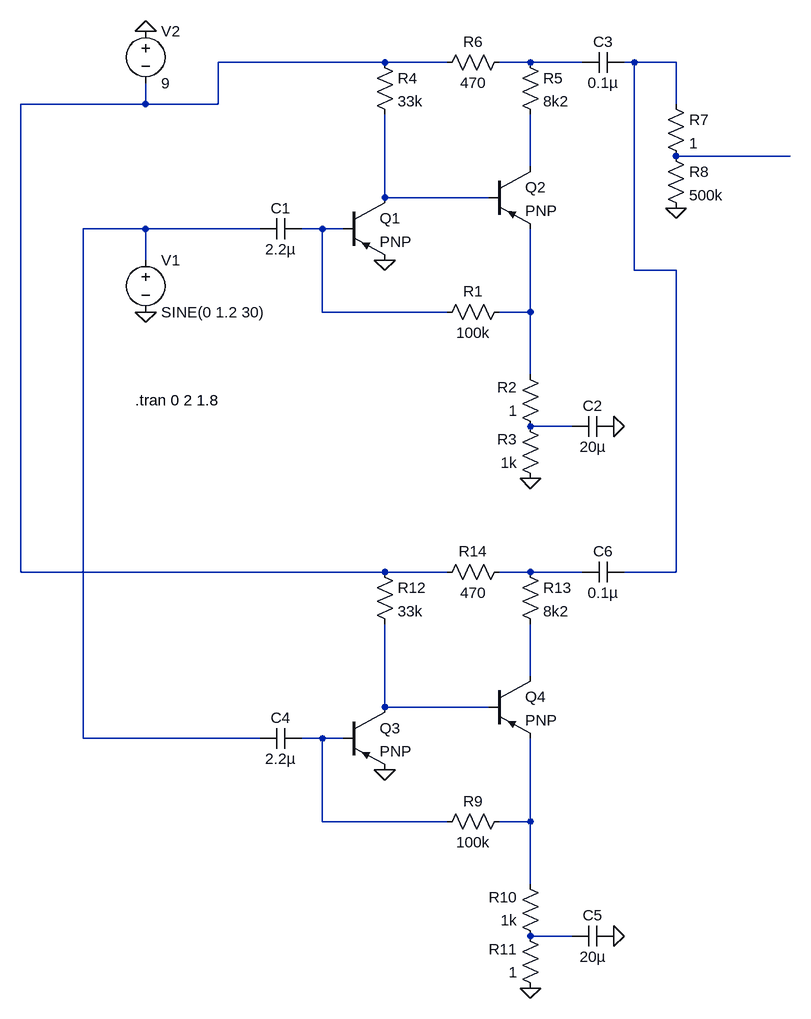
[diagram p0: schematic Draft1.asc]
Draft1.asc, the LTspice schematic file:
Version 4
SHEET 1 880 1220
WIRE 192 -224 -64 -224
WIRE 288 -224 192 -224
WIRE 416 -224 368 -224
WIRE 496 -224 416 -224
WIRE 576 -224 560 -224
WIRE 640 -224 576 -224
WIRE -176 -160 -176 -192
WIRE -176 -160 -368 -160
WIRE -64 -160 -64 -224
WIRE -64 -160 -176 -160
WIRE 640 -160 640 -224
WIRE 816 -80 640 -80
WIRE 416 -64 416 -144
WIRE 192 -16 192 -144
WIRE 352 -16 192 -16
WIRE -176 32 -272 32
WIRE 0 32 -176 32
WIRE 96 32 64 32
WIRE 128 32 96 32
WIRE -176 80 -176 32
WIRE 576 96 576 -224
WIRE 640 96 576 96
WIRE 96 160 96 32
WIRE 288 160 96 160
WIRE 416 160 416 32
WIRE 416 160 368 160
WIRE 416 256 416 160
WIRE 480 336 416 336
WIRE -368 560 -368 -160
WIRE 192 560 -368 560
WIRE 288 560 192 560
WIRE 416 560 368 560
WIRE 496 560 416 560
WIRE 640 560 640 96
WIRE 640 560 560 560
WIRE 416 720 416 640
WIRE 192 768 192 640
WIRE 352 768 192 768
WIRE -272 816 -272 32
WIRE 0 816 -272 816
WIRE 96 816 64 816
WIRE 128 816 96 816
WIRE 96 944 96 816
WIRE 288 944 96 944
WIRE 416 944 416 816
WIRE 416 944 368 944
WIRE 416 1040 416 944
WIRE 480 1120 416 1120
FLAG -176 160 0
FLAG -176 -272 0
FLAG 640 0 0
FLAG 416 416 0
FLAG 544 336 0
FLAG 192 80 0
FLAG 416 1200 0
FLAG 544 1120 0
FLAG 192 864 0
SYMBOL voltage -176 64 R0
WINDOW 123 0 0 Left 0
WINDOW 39 0 0 Left 0
SYMATTR InstName V1
SYMATTR Value SINE(0 1.2 30)
SYMBOL voltage -176 -288 R0
WINDOW 123 0 0 Left 0
WINDOW 39 0 0 Left 0
SYMATTR InstName V2
SYMATTR Value 9
SYMBOL pnp 128 -16 R0
SYMATTR InstName Q1
SYMBOL pnp 352 -64 R0
SYMATTR InstName Q2
SYMBOL cap 64 16 R90
WINDOW 0 0 32 VBottom 2
WINDOW 3 32 32 VTop 2
SYMATTR InstName C1
SYMATTR Value 2.2µ
SYMBOL res 384 144 R90
WINDOW 0 0 56 VBottom 2
WINDOW 3 32 56 VTop 2
SYMATTR InstName R1
SYMATTR Value 100k
SYMBOL res 432 352 R180
WINDOW 0 36 76 Left 2
WINDOW 3 36 40 Left 2
SYMATTR InstName R2
SYMATTR Value 1
SYMBOL res 432 432 R180
WINDOW 0 36 76 Left 2
WINDOW 3 36 40 Left 2
SYMATTR InstName R3
SYMATTR Value 1k
SYMBOL cap 544 320 R90
WINDOW 0 0 32 VBottom 2
WINDOW 3 32 32 VTop 2
SYMATTR InstName C2
SYMATTR Value 20µ
SYMBOL res 176 -240 R0
SYMATTR InstName R4
SYMATTR Value 33k
SYMBOL res 400 -240 R0
SYMATTR InstName R5
SYMATTR Value 8k2
SYMBOL res 384 -240 R90
WINDOW 0 0 56 VBottom 2
WINDOW 3 32 56 VTop 2
SYMATTR InstName R6
SYMATTR Value 470
SYMBOL cap 560 -240 R90
WINDOW 0 0 32 VBottom 2
WINDOW 3 32 32 VTop 2
SYMATTR InstName C3
SYMATTR Value 0.1µ
SYMBOL res 624 -176 R0
SYMATTR InstName R7
SYMATTR Value 1
SYMBOL res 624 -96 R0
SYMATTR InstName R8
SYMATTR Value 500k
SYMBOL pnp 128 768 R0
SYMATTR InstName Q3
SYMBOL pnp 352 720 R0
SYMATTR InstName Q4
SYMBOL res 384 928 R90
WINDOW 0 0 56 VBottom 2
WINDOW 3 32 56 VTop 2
SYMATTR InstName R9
SYMATTR Value 100k
SYMBOL res 432 1136 R180
WINDOW 0 36 76 Left 2
WINDOW 3 36 40 Left 2
SYMATTR InstName R10
SYMATTR Value 1k
SYMBOL res 432 1216 R180
WINDOW 0 36 76 Left 2
WINDOW 3 36 40 Left 2
SYMATTR InstName R11
SYMATTR Value 1
SYMBOL cap 544 1104 R90
WINDOW 0 0 32 VBottom 2
WINDOW 3 32 32 VTop 2
SYMATTR InstName C5
SYMATTR Value 20µ
SYMBOL res 176 544 R0
SYMATTR InstName R12
SYMATTR Value 33k
SYMBOL res 400 544 R0
SYMATTR InstName R13
SYMATTR Value 8k2
SYMBOL res 384 544 R90
WINDOW 0 0 56 VBottom 2
WINDOW 3 32 56 VTop 2
SYMATTR InstName R14
SYMATTR Value 470
SYMBOL cap 560 544 R90
WINDOW 0 0 32 VBottom 2
WINDOW 3 32 32 VTop 2
SYMATTR InstName C6
SYMATTR Value 0.1µ
SYMBOL cap 64 800 R90
WINDOW 0 0 32 VBottom 2
WINDOW 3 32 32 VTop 2
SYMATTR InstName C4
SYMATTR Value 2.2µ
TEXT -192 296 Left 2 !.tran 0 2 1.8

The netlist it stands for:
* Draft1.asc
V1 N007 0 SINE(0 1.2 30)
V2 0 N001 9
Q1 N006 N008 0 0 PNP
Q2 N005 N006 N009 0 PNP
C1 N008 N007 2.2µ
R1 N009 N008 100k
R2 N010 N009 1
R3 0 N010 1k
C2 0 N010 20µ
R4 N001 N006 33k
R5 N002 N005 8k2
R6 N002 N001 470
C3 N003 N002 0.1µ
R7 N003 N004 1
R8 N004 0 500k
Q3 N013 N014 0 0 PNP
Q4 N012 N013 N015 0 PNP
R9 N015 N014 100k
R10 N016 N015 1k
R11 0 N016 1
C5 0 N016 20µ
R12 N001 N013 33k
R13 N011 N012 8k2
R14 N011 N001 470
C6 N003 N011 0.1µ
C4 N014 N007 2.2µ
.model NPN NPN
.model PNP PNP
.lib standard.bjt
.tran 0 2 1.8
.backanno
.end